# Altium schematic sheet Stepper Motor.SchDoc
size A4
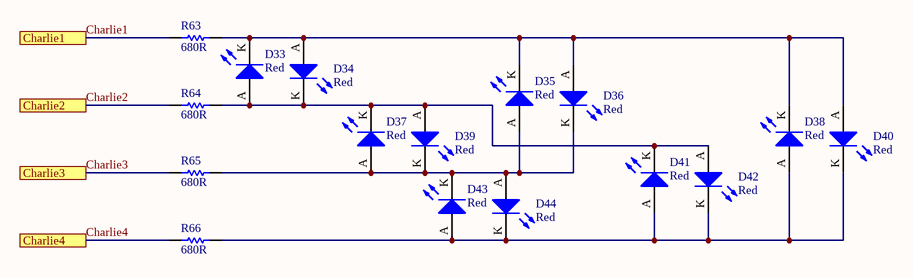
[diagram p0: Stepper Motor.SchDoc]

## Parts
D33  Red  [0805 LED]
D34  Red  [0805 LED]
D35  Red  [0805 LED]
D36  Red  [0805 LED]
D37  Red  [0805 LED]
D38  Red  [0805 LED]
D39  Red  [0805 LED]
D40  Red  [0805 LED]
D41  Red  [0805 LED]
D42  Red  [0805 LED]
D43  Red  [0805 LED]
D44  Red  [0805 LED]
R63  680R  [0805]
R64  680R  [0805]
R65  680R  [0805]
R66  680R  [0805]

## Ports
Charlie1, Charlie2, Charlie3, Charlie4

## Nets
Charlie1: R63.2 ; port Charlie1
Charlie2: R64.2 ; port Charlie2
Charlie3: R65.2 ; port Charlie3
Charlie4: R66.2 ; port Charlie4
NetD33_A: D33.A D34.K D37.K D39.A D41.K D42.A R64.1
NetD33_K: D33.K D34.A D35.K D36.A D38.K D40.A R63.1
NetD35_A: D35.A D36.K D37.A D39.K D43.K D44.A R65.1
NetD38_A: D38.A D40.K D41.A D42.K D43.A D44.K R66.1

## Notes on the sheet
- Title
- Size:
- Date:
- A4
- Number:
- Time:
- Revision:
- Sheet
- of
- File:

## Library data of the parts
D33-D44 = SML-210LTT86: Red LED Indication - Discrete 1.75V 0805 (2012 Metric); Manufacturer: ROHM Semiconductor; Part Number: SML-210LTT86; Colour: Red; Digikey Part Number: 511-1286-1-ND; Digikey Link: https://www.digikey.com/product-detail/en/rohm-semiconductor/SML-210LTT86/511-1286-1-ND/637099
R63-R66 = RC0805FR07680RL: Manufacturer: YAGEO; Tolerance: 0.01; Rated Voltage: 0.125W; Part Number: RC0805FR07680RL; Value: 680R; Material: FR-07; qty: 50